# Altium schematic sheet IO_Buffer_SN74AHCT541.SchDoc
size A4; Organization: Altium Limited; Address1: L3, 12a Rodborough Rd; Address2: Frenchs Forest; Address3: NSW; Address4: Australia 2086
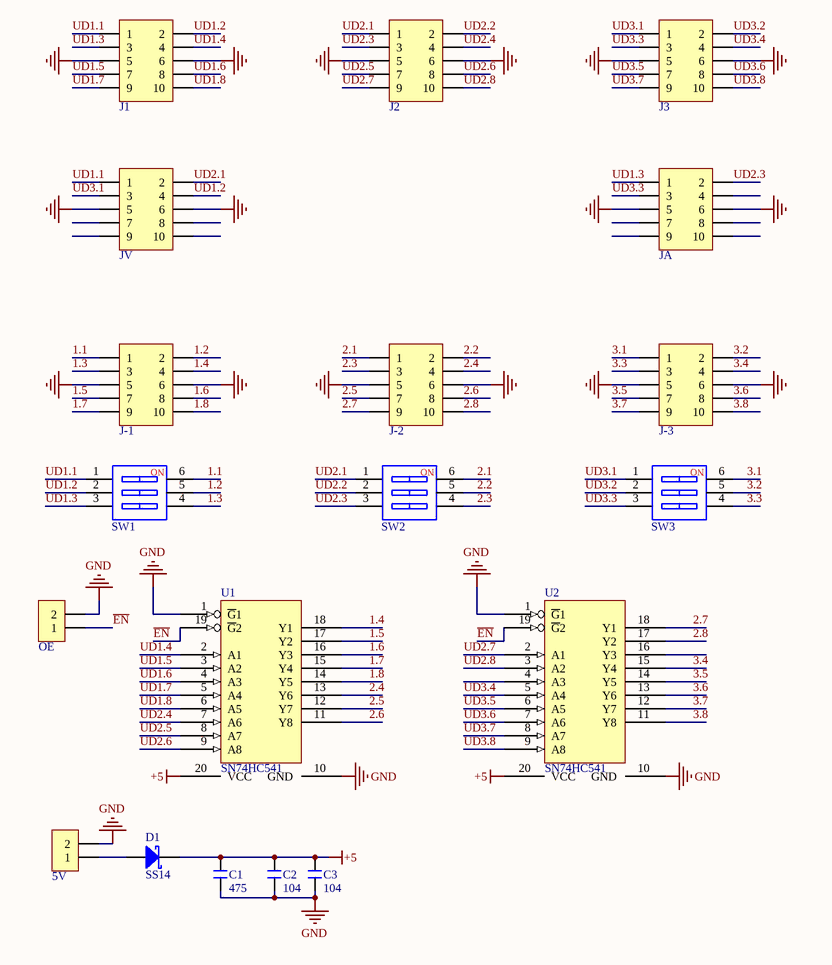
[diagram p0: IO_Buffer_SN74AHCT541.SchDoc]

## Parts
5V  HDR-1X2  [HDR2.54-LI-2P]  (value not drawn)
C1  475  [C 0805_L]
C2  104  [C 0805_L]
C3  104  [C 0805_L]
D1  SS14  [SMA]
J1  Header 5X2  [HDR2.54-LI-2x5P]  (value not drawn)
J2  Header 5X2  [HDR2.54-LI-2x5P]  (value not drawn)
J3  Header 5X2  [HDR2.54-LI-2x5P]  (value not drawn)
J-1  Header 5X2  [IDC2.54-LI-2x5P]  (value not drawn)
J-2  Header 5X2  [IDC2.54-LI-2x5P]  (value not drawn)
J-3  Header 5X2  [IDC2.54-LI-2x5P]  (value not drawn)
JA  Header 5X2  [IDC2.54-LI-2x5P]  (value not drawn)
JV  Header 5X2  [IDC2.54-LI-2x5P]  (value not drawn)
OE  HDR-1X2  [HDR2.54-LI-2P]  (value not drawn)
SW1  SW-3P  [CSW DIP-3P]  (value not drawn)
SW2  SW-3P  [CSW DIP-3P]  (value not drawn)
SW3  SW-3P  [CSW DIP-3P]  (value not drawn)
U1  SN74HC541  [TSSOP20_N]
U2  SN74HC541  [TSSOP20_N]

## Nets
+5: C1.2 C2.2 C3.2 D1.2(K) U1.20(VCC) U2.20(VCC)  [also labelled VCC]
GND: 5V.2 C1.1 C2.1 C3.1 J1.5 J1.6 J2.5 J2.6 J3.5 J3.6 J-1.5 J-1.6 J-2.5 J-2.6 J-3.5 J-3.6 JA.5 JA.6 JV.5 JV.6 OE.2 U1.1(~{G}1) U1.10(GND) U2.1(~{G}1) U2.10(GND)
1.1: J-1.1 SW1.6
1.2: J-1.2 SW1.5
1.3: J-1.3 SW1.4
1.4: J-1.4 U1.18(Y1)
1.5: J-1.7 U1.17(Y2)
1.6: J-1.8 U1.16(Y3)
1.7: J-1.9 U1.15(Y4)
1.8: J-1.10 U1.14(Y5)
2.1: J-2.1 SW2.6
2.2: J-2.2 SW2.5
2.3: J-2.3 SW2.4
2.4: J-2.4 U1.13(Y6)
2.5: J-2.7 U1.12(Y7)
2.6: J-2.8 U1.11(Y8)
2.7: J-2.9 U2.18(Y1)
2.8: J-2.10 U2.17(Y2)
3.1: J-3.1 SW3.6
3.2: J-3.2 SW3.5
3.3: J-3.3 SW3.4
3.4: J-3.4 U2.15(Y4)
3.5: J-3.7 U2.14(Y5)
3.6: J-3.8 U2.13(Y6)
3.7: J-3.9 U2.12(Y7)
3.8: J-3.10 U2.11(Y8)
~{EN}: OE.1 U1.19(~{G}2) U2.19(~{G}2)
UD1.1: J1.1 JV.1 SW1.1
UD1.2: J1.2 JV.4 SW1.2
UD1.3: J1.3 JA.1 SW1.3
UD1.4: J1.4 U1.2(A1)
UD1.5: J1.7 U1.3(A2)
UD1.6: J1.8 U1.4(A3)
UD1.7: J1.9 U1.5(A4)
UD1.8: J1.10 U1.6(A5)
UD2.1: J2.1 JV.2 SW2.1
UD2.2: J2.2 SW2.2
UD2.3: J2.3 JA.2 SW2.3
UD2.4: J2.4 U1.7(A6)
UD2.5: J2.7 U1.8(A7)
UD2.6: J2.8 U1.9(A8)
UD2.7: J2.9 U2.2(A1)
UD2.8: J2.10 U2.3(A2)
UD3.1: J3.1 JV.3 SW3.1
UD3.2: J3.2 SW3.2
UD3.3: J3.3 JA.3 SW3.3
UD3.4: J3.4 U2.5(A4)
UD3.5: J3.7 U2.6(A5)
UD3.6: J3.8 U2.7(A6)
UD3.7: J3.9 U2.8(A7)
UD3.8: J3.10 U2.9(A8)
Net5V_1: 5V.1 D1.1(A)

Not connected (* = marked no-connect by the designer): JA 4 7 8 9 10; JV 7 8 9 10; U2 4(A3) 16(Y3)

## Notes on the sheet
- Title
- Size:
- Date:
- A4
- Number:
- Time:
- Revision:
- Sheet
- of
- File:
- (in symbol SW-3P) NO

## Library data of the parts
5V OE = Header 2: 2P接插件; 淘宝ID: 小糖豆的小窝窝; BOM名称: 2P接插件; 下单链接: https://item.taobao.com/item.htm?ft=t&id=613637044352
C1-C3 = C: 贴片电容; 淘宝ID: 小糖豆的小窝窝; BOM名称: 贴片电容; 下单链接: https://item.taobao.com/item.htm?ft=t&id=613637044352
D1 = SS14: 肖特基二极管; 淘宝ID: 小糖豆的小窝窝; BOM名称: 肖特基二极管; 下单链接: https://item.taobao.com/item.htm?ft=t&id=613637044352
J1-J3 J-1-J-3 JA JV = Header 5X2: 5*2P接插件; 淘宝ID: 小糖豆的小窝窝; BOM名称: 5*2P接插件; 下单链接: https://item.taobao.com/item.htm?ft=t&id=613637044352
SW1-SW3 = SW-3P: 3路编码开关; 淘宝ID: 小糖豆的小窝窝; BOM名称: 3路编码开关; 下单链接: https://item.taobao.com/item.htm?ft=t&id=613637044352
U1 U2 = SN74HC541: OCTAL BUF AND LINE DRV 3SO; Alias2: 小糖豆的小窝窝